# Altium schematic sheet Analog_Input.SchDoc
size A4
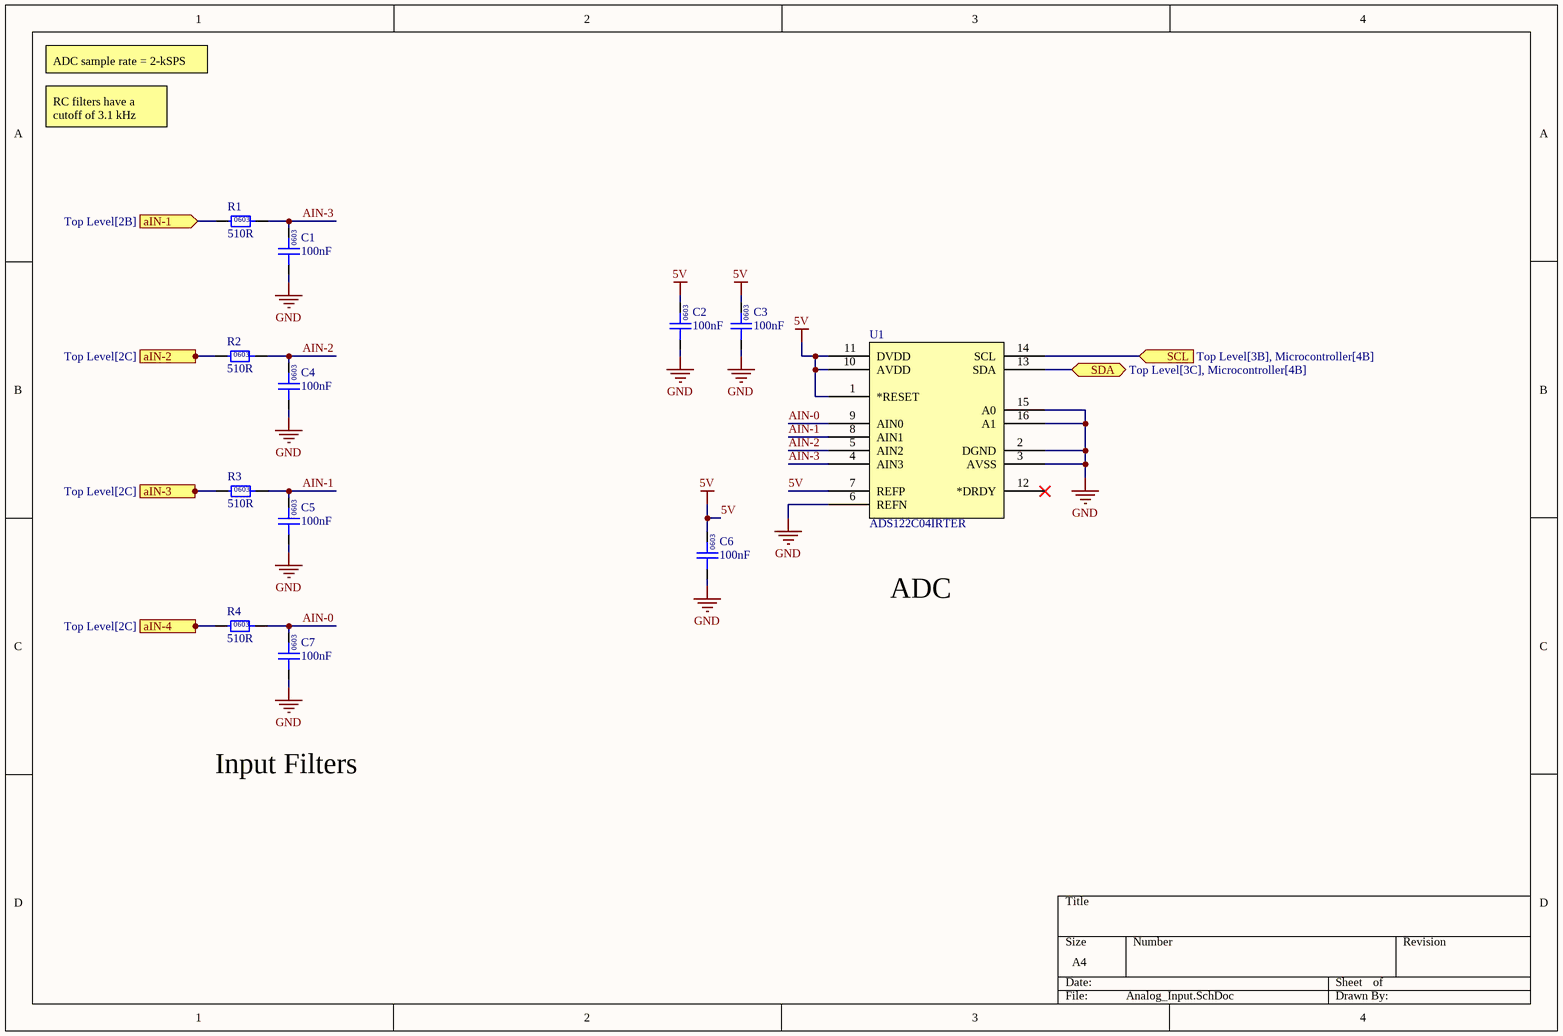
[diagram p0: Analog_Input.SchDoc]

## Parts
C1  100nF  [0603]
C2  100nF  [0603]
C3  100nF  [0603]
C4  100nF  [0603]
C5  100nF  [0603]
C6  100nF  [0603]
C7  100nF  [0603]
R1  510R  [0603]
R2  510R  [0603]
R3  510R  [0603]
R4  510R  [0603]
U1  ADS122C04IRTER  [TI 16-WQFN (3x3)]

## Ports
aIN-1 (in, see Top Level[2B]), aIN-2 (in, see Top Level[2C]), aIN-3 (in, see Top Level[2C]), aIN-4 (in, see Top Level[2C]), SCL (in, see Top Level[3B], Microcontroller[4B]), SDA (bidir, see Top Level[3C], Microcontroller[4B])

## Nets
5V: C2.2 C3.2 C6.2 U1.1(*RESET) U1.7(REFP) U1.10(AVDD) U1.11(DVDD)
GND: C1.1 C2.1 C3.1 C4.1 C5.1 C6.1 C7.1 U1.2(DGND) U1.3(AVSS) U1.6(REFN) U1.15(A0) U1.16(A1)
AIN-0: C7.2 R4.2 U1.9(AIN0)
aIN-1: R1.1 ; port aIN-1
AIN-1: C5.2 R3.2 U1.8(AIN1)  [a separate net that carries the same name]
AIN-2: C4.2 R2.2 U1.5(AIN2)
aIN-2: R2.1 ; port aIN-2  [a separate net that carries the same name]
AIN-3: C1.2 R1.2 U1.4(AIN3)
aIN-3: R3.1 ; port aIN-3  [a separate net that carries the same name]
aIN-4: R4.1 ; port aIN-4
SCL: U1.14(SCL) ; port SCL
SDA: U1.13(SDA) ; port SDA

Not connected (* = marked no-connect by the designer): U1 12(*DRDY)*

## Notes on the sheet
- ADC sample rate = 2-kSPS
- RC filters have a cutoff of 3.1 kHz
- ADC
- Input Filters
- (in symbol GCM188L81H104KA57D) 0603
- (in symbol RC0603FR-07510RL) 0603

## Library data of the parts
C1-C7 = GCM188L81H104KA57D: Manufacturer: muRata; Rated Voltage: 50V; Tolerance: ±10%; Material: MLCC; Temperature Rating: X8L; Part Number: GCM188L81H104KA57D; Value: 100nF; Digikey Part Number: 490-6049-1-ND
R1-R4 = RC0603FR-07510RL: Manufacturer: YAGEO; Tolerance: 0.01; Rated Power: 0.1W; Part Number: RC0603FR-07510RL; Value: 510R; Material: FR-07; Digikey Part Number: 311-510HRCT-ND
U1 = ADS122C04IRTER: IC ADC 24BIT SIGMA-DELTA 16WQFN; Manufacturer: Texas Instruments; Complex IC: 1; Part Number: ADS122C04IRTER; Digikey Part Number: 296-50886-1-ND; Digikey Link: https://www.digikey.com.au/en/products/detail/texas-instruments/ADS122C04IRTER/9665929